# Altium schematic sheet Sheet1.SchDoc
size A4; SheetNumber: 1; SheetTotal: 1
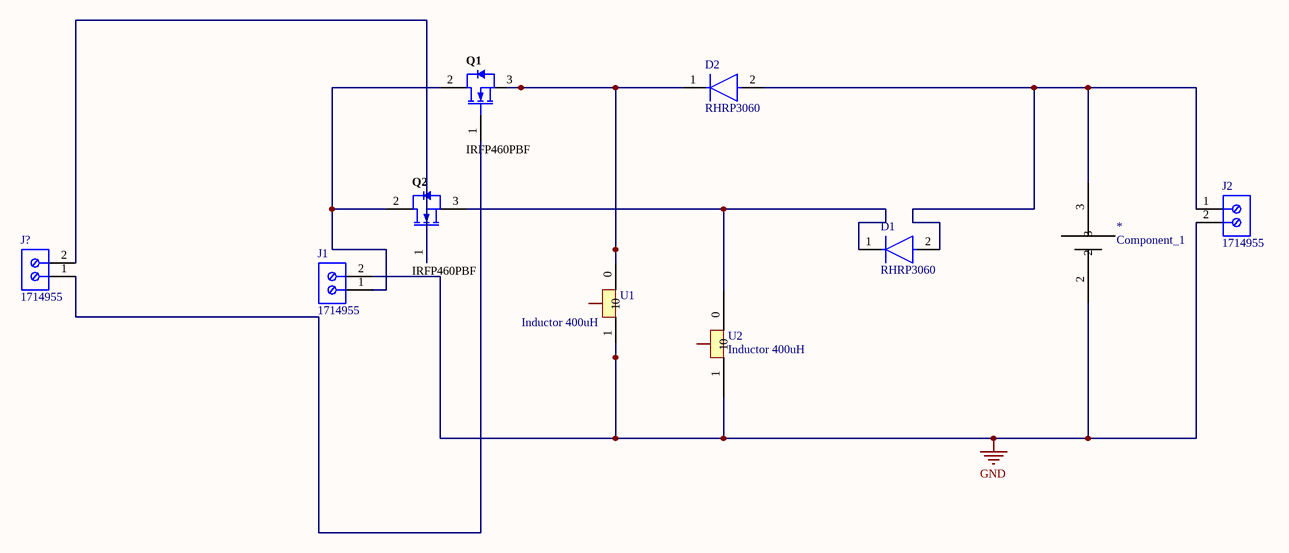
[diagram p0: Sheet1.SchDoc]

## Parts
*  Component_1  [capacitor]
D1  RHRP3060  [FP-340BA-MFG]
D2  RHRP3060  [FP-340BA-MFG]
J1  1714955  [PHOE-1714955_V]
J2  1714955  [PHOE-1714955_V]
J?  1714955  [PHOE-1714955_V]
Q1  IRFP460PBF  [VISH-TO-247AC-3]
Q2  IRFP460PBF  [VISH-TO-247AC-3]
U1  Inductor 400uH  [inductor]
U2  Inductor 400uH  [inductor]

## Nets
GND: *.2 J1.2 J2.2 U1.1 U2.1
Net*_3: *.3 D1.2(A) D2.2(A) J2.1
NetD1_1: D1.1(C) Q2.3(S) U2.0
NetD2_1: D2.1(C) Q1.3(S) U1.0
NetJ1_1: J1.1 Q1.2(D) Q2.2(D)
NetJ?_1: J?.1 Q1.1(G)
NetJ?_2: J?.2 Q2.1(G)

## Library data of the parts
D1 D2 = CMP-00278-84331219-1: RHRP3060 Diode Ultra Fast Recovery Rectifier 600V 30A 2-Pin (2+Tab) TO-220AC Rail; Manufacturer Lifecycle Status: LIFETIME; Forward Voltage: 2.1V; Recovery Time: 45ns; Element Configuration: Single; Max Forward Surge Current (Ifsm): 325A; Max Junction Temperature (Tj): 175°C; Polarity: Standard; Peak Reverse Current: 250µA; Power Dissipation: 125W; Capacitance: 85pF; Number of Pins: 2; Width: 4.83mm; REACH SVHC: No SVHC; Schedule B: 8541100080, 8541100080; Max Surge Current: 325A; Reverse Voltage: 600V; Average Rectified Current: 30A; Radiation Hardening: No; Min Operating Temperature: -65°C; Lead Free: Lead Free; Length: 10.67mm; RoHS: Compliant; Reverse Recovery Time: 45ns; Weight: 2.16g; Output Current: 30A; NexarPartId: 84331219; Peak Non-Repetitive Surge Current: 325A; Voltage Rating (DC): 600V; Max Repetitive Reverse Voltage (Vrrm): 600V; Height: 9.65mm; Current Rating: 30A; Max Operating Temperature: 175°C; Lifecycle Status: EOL; Mount: Through Hole; Max Reverse Voltage (DC): 600V; Case/Package: TO-220-2; Forward Current: 30A
J1 J2 J? = CMP-2000-05797-1: PC Terminal Block, Pitch 6.35 mm, 1 x 2 Position, Height 21.5 mm, Tail Lenght 5.1 mm, RoHS, Bulk; Manufacturer: Phoenix Contact; Package Description: PC Terminal Block, Pitch 6.35 mm, 1 x 2 Position, Height 21.5 mm, Tail Lenght 5.1 mm; Datasheet URL: http://media.digikey.com/pdf/Data%20Sheets/Phoenix%20Contact%20PDFs/1714955.pdf; Package Reference: 1714955; Manufacturer URL: http://www.phoenixcontact.com/; Datasheet Version: 02/2010; Mounting Technology: ThroughHole
Q1 Q2 = CMP-2000-06478-1: N-Channel Power MOSFET, 500 V, -55 to 150 degC, 3-Pin FM (TO-247), RoHS, Tube; Manufacturer: Vishay; Drain Source Voltage Vds: 500V; No. of Pins: 3Pins; On Resistance Rds(on): 0.27ohm; Transistor Polarity: NChannel; Power Dissipation Pd: 280W; Threshold Voltage Vgs: 4V; Transistor Case Style: TO-247AC; Continuous Drain Current Id: 20A; Rds(on) Test Voltage Vgs: 10V; SVHC: ToBeAdvised; Mounting Technology: ThroughHole; Automotive Qualification Standard: -; Datasheet Version: Rev. A, 07/2008; Package Reference: TO-247AC-3; Package Description: 3-Pin Flange Mount Package, Body 15.58 x 4.945 mm, Pitch 5.46 mm; Operating Temperature Max: 150°C; Product Range: -; Manufacturer URL: http://www.vishay.com/; MSL: -; Datasheet URL: https://datasheet.ciiva.com/17070/0900766b8079122f-17070730.pdf